# EAGLE design airball_sensor_board_v8_main (EAGLE 9.6.0)

## Sheet 1 of 3
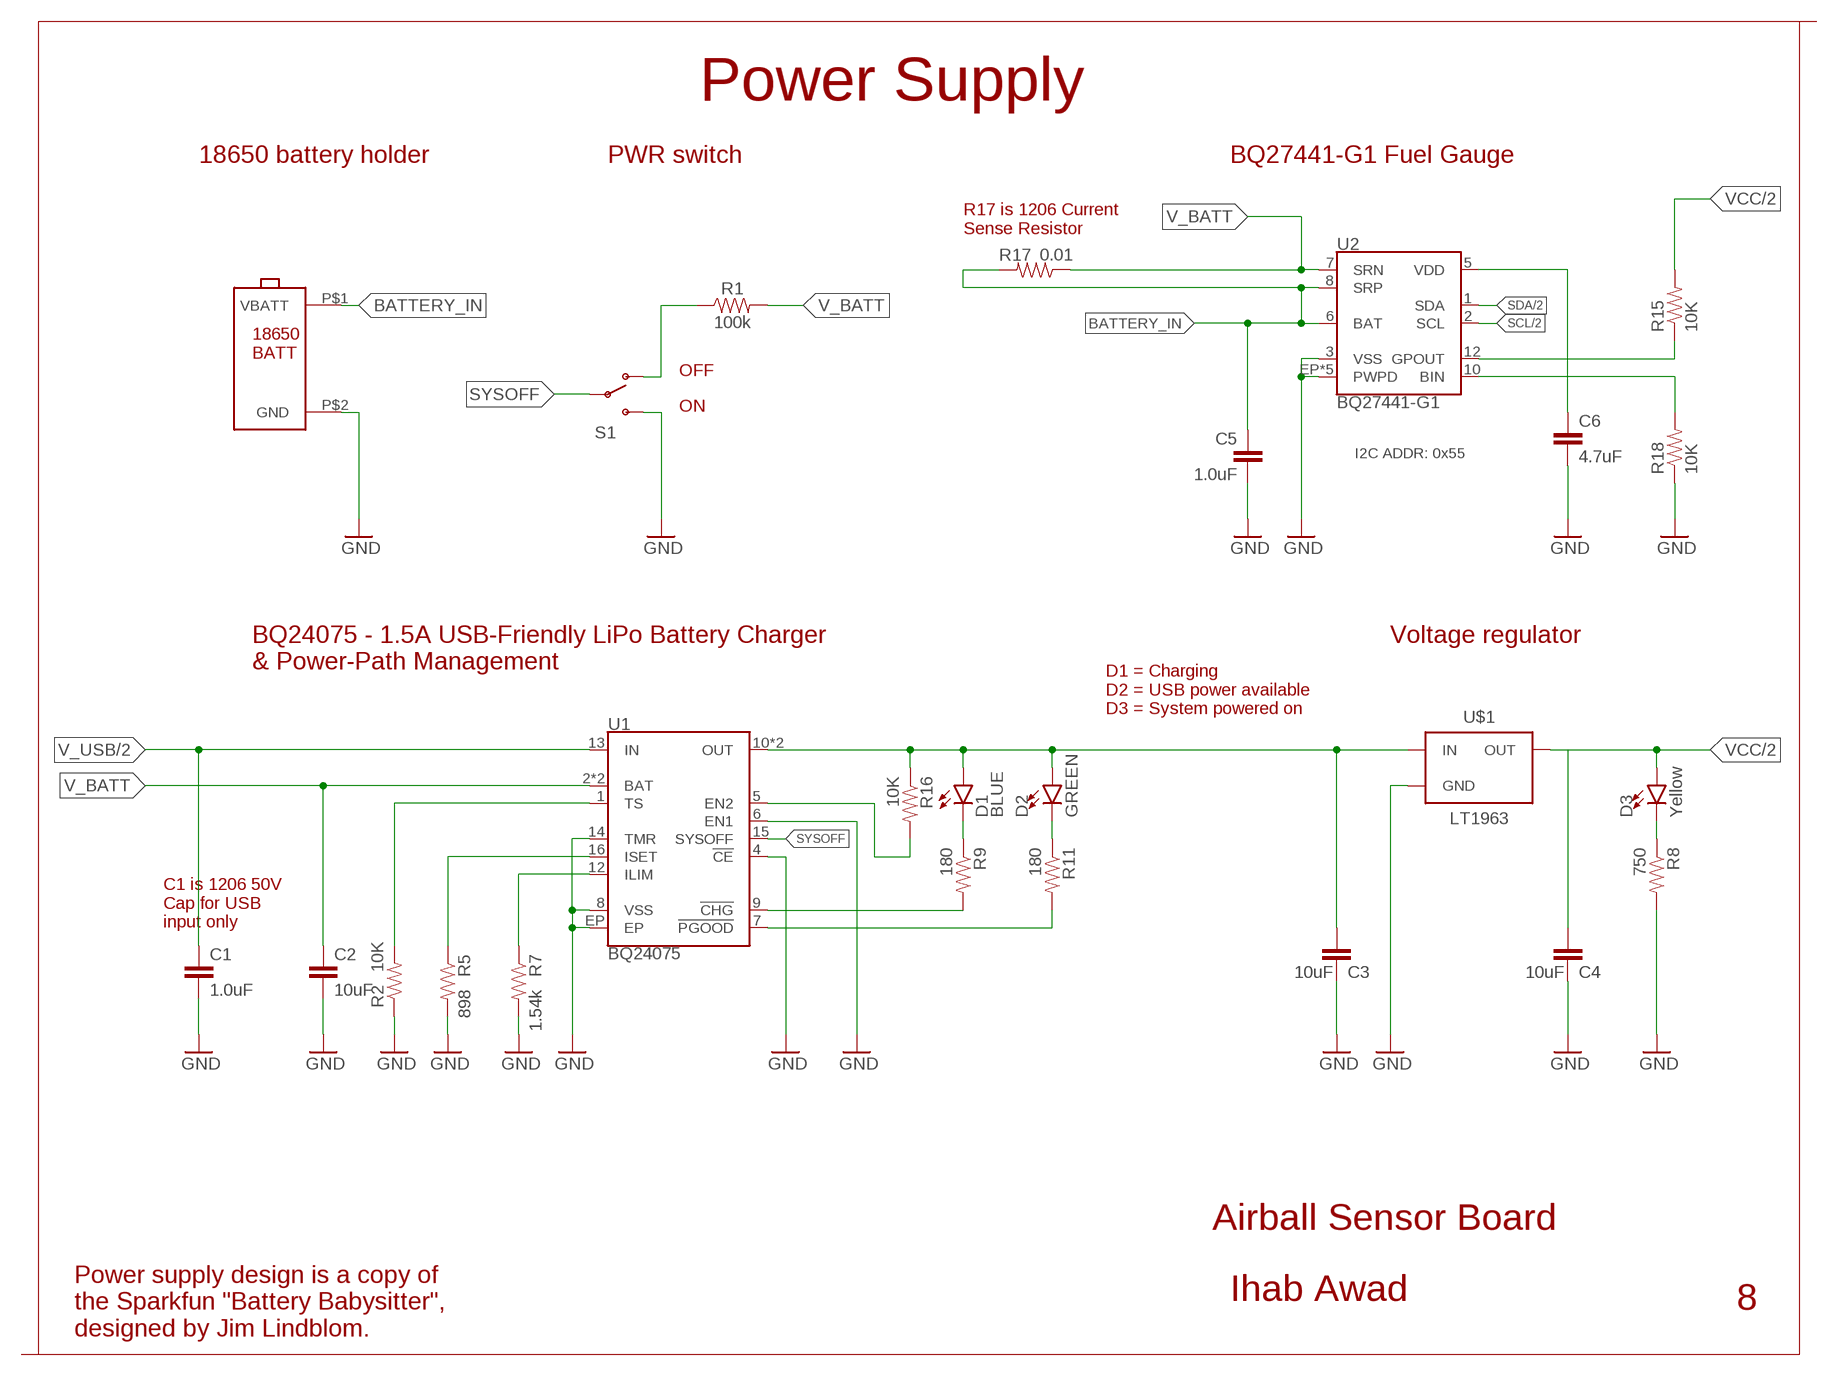
[diagram p0: schematic, sheet 1]

### Parts
C1  1.0uF  1.0UF50V10%(1206)  [1206-CAP]
C2  10uF  10UF10V10%(0805)  [0805-CAP]
C3  10uF  10UF10V10%(0805)  [0805-CAP]
C4  10uF  10UF10V10%(0805)  [0805-CAP]
C5  1.0uF  1.0UF-16V-10%(0603)  [0603-CAP]
C6  4.7uF  4.7UF-0603-35V-(20%)  [0603]
D1  BLUE  LED-BLUE0603  [LED-0603]
D2  GREEN  LED-GREEN0603  [LED-0603]
D3  Yellow  LED-YELLOW0603  [LED-0603]
R1  100k  100KOHM-0603-1/10W-1%  [0603]
R2  10K  10KOHM-1/10W-1%(0603)0603  [0603-RES]
R5  898  RESISTOR0603-RES  [0603-RES]
R7  1.54k  RESISTOR0603-RES  [0603-RES]
R8  750  10KOHM-1/10W-1%(0603)0603  [0603-RES]
R9  180  180OHM1/10W1%(0603)  [0603-RES]
R11  180  180OHM1/10W1%(0603)  [0603-RES]
R15  10K  10KOHM-1/10W-1%(0603)0603  [0603-RES]
R16  10K  10KOHM-1/10W-1%(0603)0603  [0603-RES]
R17  0.01  RESISTOR1206  [1206]
R18  10K  10KOHM-1/10W-1%(0603)0603  [0603-RES]
S1  SWITCH-SPDTSMD  [SWITCH_SPDT_SMD]
U1  BQ24075  [PVQFN-N16]
U2  BQ27441-G1  [PDSO-N12]
U$1  LT1963  [SOT223-3]
U$2  KEYSTONE_1042P_18650_BATT_HOLDER  [KEYSTONE_1042P_18650_BATT_HOLDER]

### Nets
!CHG!: R9.2 U1.9(!CHG!)
BATTERY_IN: C5.1 R17.2 U2.6(BAT) U2.8(SRP) U$2.P$1(VBATT)
GND: C1.2 C2.2 C3.2 C4.2 C5.2 C6.2 R2.1 R5.2 R7.2 R8.2 R18.1 S1.3(S) U1.4(!CE!) U1.6(EN1) U1.8(VSS) U1.14(TMR) U1.EP U2.3(VSS) U2.EP1(PWPD) U2.EP2(PWPD) U2.EP3(PWPD) U2.EP4(PWPD) U2.EP(PWPD) U$1.2(GND) U$1.TAB(GND) U$2.P$2(GND) ; also sheet 2,3
GPOUT: R15.1 U2.12(GPOUT)
ILIM: R7.1 U1.12(ILIM)
ISET: R5.1 U1.16(ISET)
N$11: D1.C R9.1
N$14: C6.1 U2.5(VDD)
N$19: R11.2 U1.7(!PGOOD!)
N$20: D2.C R11.1
N$21: R16.2 U1.5(EN2)
N$22: D3.C R8.1
N$23: R18.2 U2.10(BIN)
SCL: U2.2(SCL) ; also sheet 2,3
SDA: U2.1(SDA) ; also sheet 2,3
SYSOFF: S1.2(P) U1.15(SYSOFF)
SYSOFF_PULLUP: R1.1 S1.1(O)
TS: R2.2 U1.1(TS)
V_BATT: C2.1 R1.2 R17.1 U1.2(BAT) U1.3(BAT) U2.7(SRN)
V_SUPPLY_UNREG: C3.1 D1.A D2.A R16.1 U1.10(OUT) U1.11(OUT) U$1.1(IN)
V_USB: C1.1 U1.13(IN) ; also sheet 2
VCC: C4.1 D3.A R15.2 U$1.3(OUT) ; also sheet 2,3

### Notes on the sheet
- Power Supply
- 18650 battery holder | PWR switch | BQ27441-G1 Fuel Gauge
- R17 is 1206 Current
  Sense Resistor
- OFF
- ON
- I2C ADDR: 0x55
- BQ24075 - 1.5A USB-Friendly LiPo Battery Charger 
  & Power-Path Management
- Voltage regulator
- D1 = Charging
  D2 = USB power available
  D3 = System powered on
- C1 is 1206 50V
  Cap for USB
  input only
- Airball Sensor Board
- Ihab Awad | 8
- Power supply design is a copy of
  the Sparkfun "Battery Babysitter",
  designed by Jim Lindblom.

## Sheet 2 of 3
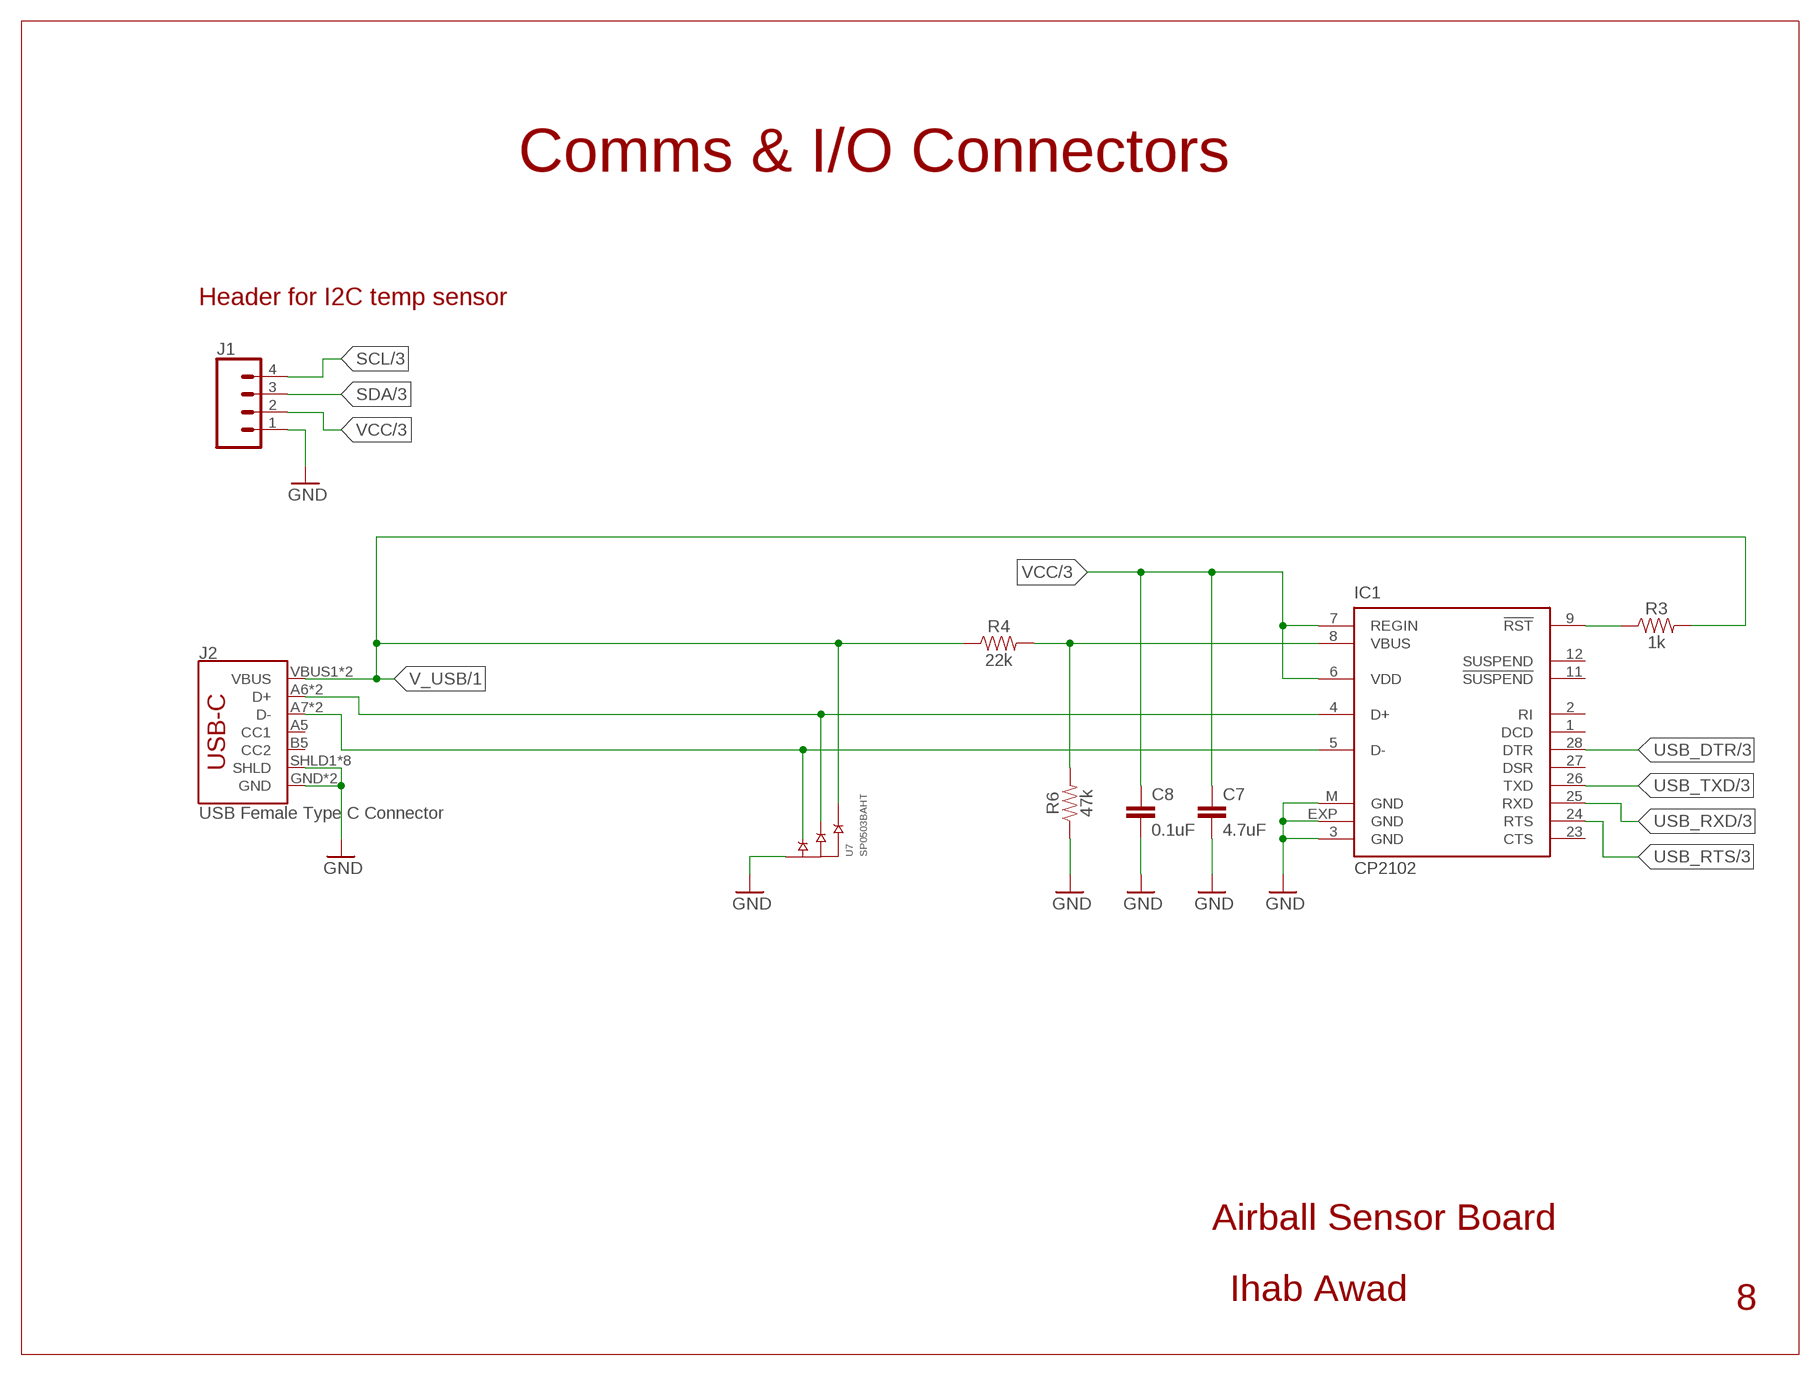
[diagram p1: schematic, sheet 2]

### Parts
C7  4.7uF  4.7UF-0603-35V-(20%)  [0603]
C8  0.1uF  0.1UF-0603-25V-(+80/-20%)  [0603]
IC1  CP2102  [MLP28]
J1  CONN_04JST-PTH  [JST-4-PTH]
J2  USB Female Type C Connector  USB_C  [USB-C-16P]
R3  1k  1KOHM-0603-1/10W-1%  [0603]
R4  22k  22KOHM-0603-1/10W-1%  [0603]
R6  47k  47KOHM-0603-1/10W-1%  [0603]
U7  SP0503BAHT  [SOT143]

### Nets
GND: C7.2 C8.2 IC1.3(GND) IC1.EXP(GND) IC1.M(GND) J1.1 J2.GND J2.GND2(GND) J2.SHLD1(SHLD) J2.SHLD2(SHLD) J2.SHLD3(SHLD) J2.SHLD4(SHLD) J2.SHLD5(SHLD) J2.SHLD6(SHLD) J2.SHLD7(SHLD) J2.SHLD8(SHLD) R6.1 U7.1(GND) ; also sheet 1,3
N$4: IC1.9(!RST) R3.1
N$5: IC1.8(VBUS) R4.2 R6.2
SCL: J1.4 ; also sheet 1,3
SDA: J1.3 ; also sheet 1,3
USB_D+: IC1.4(D+) J2.A6(D+) J2.B6(D+) U7.3(B)
USB_D-: IC1.5(D-) J2.A7(D-) J2.B7(D-) U7.2(A)
USB_DTR: IC1.28(DTR) ; also sheet 3
USB_RTS: IC1.24(RTS) ; also sheet 3
USB_RXD: IC1.25(RXD) ; also sheet 3
USB_TXD: IC1.26(TXD) ; also sheet 3
V_USB: J2.VBUS1(VBUS) J2.VBUS2(VBUS) R3.2 R4.1 U7.4(C) ; also sheet 1
VCC: C7.1 C8.1 IC1.6(VDD) IC1.7(REGIN) J1.2 ; also sheet 1,3
Unconnected: IC1.1(DCD) IC1.2(RI) IC1.11(!SUSPEND) IC1.12(SUSPEND) IC1.23(CTS) IC1.27(DSR) J2.A5(CC1) J2.B5(CC2)

### Notes on the sheet
- Comms & I/O Connectors
- Header for I2C temp sensor
- Airball Sensor Board
- Ihab Awad | 8

## Sheet 3 of 3
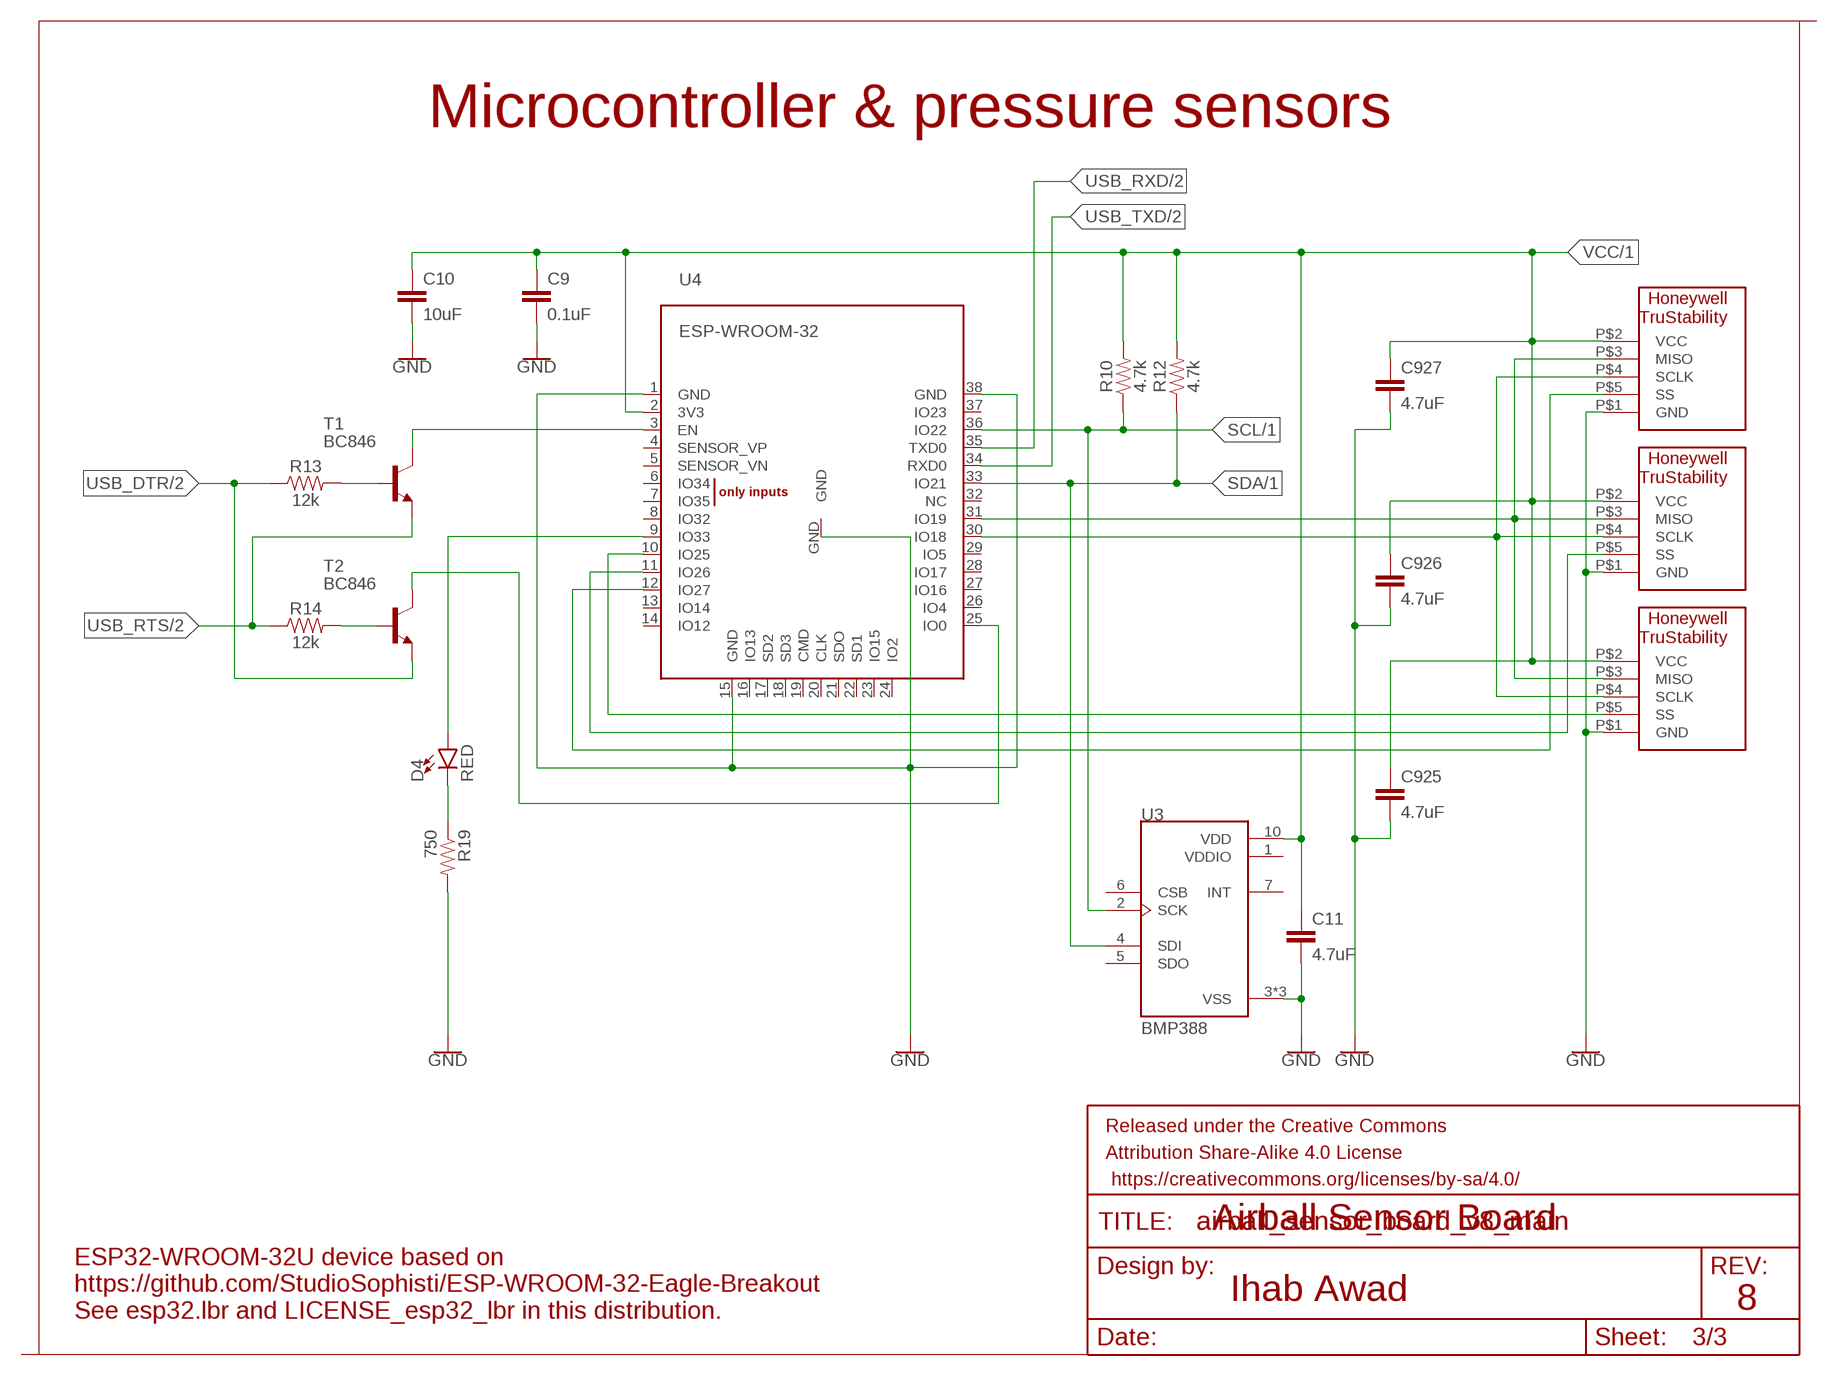
[diagram p2: schematic, sheet 3]

### Parts
C9  0.1uF  0.1UF-0603-25V-(+80/-20%)  [0603]
C10  10uF  10UF-0603-6.3V-20%  [0603]
C11  4.7uF  4.7UF-0603-6.3V-(10%)  [0603]
C925  4.7uF  4.7UF-0603-6.3V-(10%)  [0603]
C926  4.7uF  4.7UF-0603-6.3V-(10%)  [0603]
C927  4.7uF  4.7UF-0603-6.3V-(10%)  [0603]
D4  RED  LED-RED0603  [LED-0603]
FRAME3  FRAME-LETTER  [CREATIVE_COMMONS]
R10  4.7k  4.7KOHM-0603-1/10W-1%  [0603]
R12  4.7k  4.7KOHM-0603-1/10W-1%  [0603]
R13  12k  12KOHM-0603-1/10W-1%  [0603]
R14  12k  12KOHM-0603-1/10W-1%  [0603]
R19  750  10KOHM-1/10W-1%(0603)0603  [0603-RES]
T1  BC846  [SOT23]
T2  BC846  [SOT23]
U3  BMP388  [PQFN50P200X200X80-10N]
U4  ESP-WROOM-32  [ESP-WROOM-32]
U$925  HONEYWELL_HSC_SMT  [HONEYWELL_HSC_SMT]
U$926  HONEYWELL_HSC_SMT  [HONEYWELL_HSC_SMT]
U$927  HONEYWELL_HSC_SMT  [HONEYWELL_HSC_SMT]

### Nets
GND: C9.2 C10.2 C11.2 C925.2 C926.2 C927.2 R19.2 U3.3(VSS) U3.8(VSS) U3.9(VSS) U4.1(GND) U4.15(GND) U4.38(GND) U4.GND U$925.P$1(GND) U$926.P$1(GND) U$927.P$1(GND) ; also sheet 1,2
MISO: U4.31(IO19) U$925.P$3(MISO) U$926.P$3(MISO) U$927.P$3(MISO)
N$1: D4.A U4.9(IO33)
N$2: D4.C R19.1
N$7: R13.2 T1.1(B)
N$8: R14.2 T2.1(B)
N$12: T1.3(C) U4.3(EN)
N$13: T2.3(C) U4.25(IO0)
SCL: R10.1 U3.2(SCK) U4.36(IO22) ; also sheet 1,2
SCLK: U4.30(IO18) U$925.P$4(SCLK) U$926.P$4(SCLK) U$927.P$4(SCLK)
SDA: R12.1 U3.4(SDI) U4.33(IO21) ; also sheet 1,2
SS_25: U4.10(IO25) U$925.P$5(SS)
SS_26: U4.11(IO26) U$926.P$5(SS)
SS_27: U4.12(IO27) U$927.P$5(SS)
USB_DTR: R13.1 T2.2(E) ; also sheet 2
USB_RTS: R14.1 T1.2(E) ; also sheet 2
USB_RXD: U4.35(TXD0) ; also sheet 2
USB_TXD: U4.34(RXD0) ; also sheet 2
VCC: C9.1 C10.1 C11.1 C925.1 C926.1 C927.1 R10.2 R12.2 U3.10(VDD) U4.2(3V3) U$925.P$2(VCC) U$926.P$2(VCC) U$927.P$2(VCC) ; also sheet 1,2
Unconnected: U3.5(SDO) U3.6(CSB) U3.7(INT) U4.4(SENSOR_VP) U4.5(SENSOR_VN) U4.6(IO34) U4.7(IO35) U4.8(IO32) U4.13(IO14) U4.14(IO12) U4.16(IO13) U4.17(SD2) U4.18(SD3) U4.19(CMD) U4.20(CLK) U4.21(SDO) U4.22(SD1) U4.23(IO15) U4.24(IO2) U4.26(IO4) U4.27(IO16) U4.28(IO17) U4.29(IO5) U4.32(NC) U4.37(IO23)

### Notes on the sheet
- Microcontroller & pressure sensors
- Airball Sensor Board
- Ihab Awad | 8
- ESP32-WROOM-32U device based on
  https://github.com/StudioSophisti/ESP-WROOM-32-Eagle-Breakout
  See esp32.lbr and LICENSE_esp32_lbr in this distribution.

## Power pins joined to a net without a drawn wire
VDDIO: U3.1(VDDIO)

## Library data of the parts
C1 = SparkFun-Capacitors:1.0UF50V10%(1206): CAP-09822; PROD_ID: CAP-09822
C2-C4 = SparkFun-Capacitors:10UF10V10%(0805): CAP-11330; PROD_ID: CAP-11330
C5 = SparkFun-Capacitors:1.0UF-16V-10%(0603): CAP-00868; PROD_ID: CAP-00868
C6 C7 = SparkFun-Capacitors:4.7UF: 4.7µF ceramic capacitors A capacitor is a passive two-terminal electrical component used to store electrical energy temporarily in an electric field.; PROD_ID: CAP-14106
C8 C9 = SparkFun-Capacitors:0.1UF: 0.1µF ceramic capacitors A capacitor is a passive two-terminal electrical component used to store electrical energy temporarily in an electric field.; PROD_ID: CAP-00810
C10 = SparkFun-Capacitors:10UF: 10.0µF ceramic capacitors A capacitor is a passive two-terminal electrical component used to store electrical energy temporarily in an electric field.; PROD_ID: CAP-11015
C11 C925-C927 = SparkFun-Capacitors:4.7UF: 4.7µF ceramic capacitors A capacitor is a passive two-terminal electrical component used to store electrical energy temporarily in an electric field.; PROD_ID: CAP-08280
D1 = SparkFun-LED:LED-BLUE: Blue SMD LED Used in manufacturing of various products at SparkFun Packages: 0603 - SMD 0603 package [Product Link] <http://www.digikey.com/product-detail/en/SMLE12BC7TT86/511-1589-2-ND/1641808> 1206 - SMD1206 package [Product Link] <http://www.digikey.com/product-detail/en/lite-on-inc/LTST-C150TBKT/160-1643-1-ND/573584> SparkFun Products: ESP8266 Thing-Dev Board <https://www.sparkfun.com/products/13711> RedBoard <https://www.sparkfun.com/products/12757>; PROD_ID: DIO-08575
D2 = SparkFun-LED:LED-GREEN: Green SMD LED Used in manufacturing of various products at SparkFun Packages: 0603 - SMD 0603 package [Product Link] <http://www.futureelectronics.com/en/technologies/semiconductors/optoelectronics/leds/Pages/9894312-LTST-C190GKT.aspx?CrossPart=HSMG-C190&IM=0> LilyPad 1206 - SMD1206 LilyPad package [Product Link] <http://www.futureelectronics.com/en/Technologies/Product.aspx?ProductID=IN150NGHARVATEKCORPORATION2049943&IM=0> 1206 - SMD1206 package [Product Link] <http://www.futureelectronics.com/en/technologies/semiconductors/optoelectronics/leds/Pages/8315665-LTST-C150KGKT.aspx?IM=0> 1206 Bottom Mount -SMD 1206 Bottom Mount [Product Link] <http://www.digikey.com/product-detail/en/lite-on-inc/LTST-C230KGKT/160-1456-1-ND/386854> SparkFun Products: Pro Mini 328 -5V <https://www.sparkfun.com/products/821> RedBoard <https://www.sparkfun.com/products/12757> MP3 Trigger <https://www.sparkfun.com/products/13720> Makey Makey <https://www.sparkfun.com/products/11076>; PROD_ID: DIO-00821
D3 = SparkFun-LED:LED-YELLOW: Yellow SMD LED Used in manufacturing several products at SparkFun. Packages: 0603 - SMD 0603 package[Product Link] <http://www.kingbrightusa.com/product.asp?catalog_name=LED&product_id=APT1608SYCK> 0603 -SMART - SMART SMD 0603 package (more efficient/more expensive) [Product Link] <http://www.osram-os.com/osram_os/en/products/product-catalog/led-light-emitting-diodes/smartled-0603/ly-l29k/index.jsp> LilyPad - SMD1206 package[Product Datasheet] <https://www.sparkfun.com/datasheets/DevTools/LilyPad/Q150YUS4.pdf> SparkFun Products: Blynk Board <https://www.sparkfun.com/products/13794> IOIO-OTG <https://www.sparkfun.com/products/13613> XBee Explorer Serial <https://www.sparkfun.com/products/13225>; PROD_ID: DIO-09003
D4 = SparkFun-LED:LED-RED: Red SMD LED Used in manufacturing of most products at SparkFun Packages: 0603 - SMD 0603 package [Product Link] <http://docs.avagotech.com/docs/AV02-0551EN> 0603 SMART - SMD 0603 SMART package ( more efficient and expensive)[Product Link] <http://www.osram-os.com/Graphics/XPic2/00077099_0.pdf> 1206 - SMD1206 package [Product Link] <https://www.sparkfun.com/datasheets/DevTools/LilyPad/Q150OVS4.pdff> SparkFun Products: Pro Mini 328 -5V <https://www.sparkfun.com/products/821> RedBoard <https://www.sparkfun.com/products/12757> IOIO-OTG <https://www.sparkfun.com/products/13613>; PROD_ID: DIO-00819
FRAME3 = SparkFun-Aesthetics:FRAME-LETTER: Schematic Frame Standard 8.5x11 US Letter frame
IC1 = silabs:CP210*: Single-Chip USB to UART Bridge Source: www.silabs.com .. CP2101.pdf / cp2102.pdf; MF: FARNELL; MPN: CP2102-GM; OC_FARNELL: 9282130; OC_NEWARK: 30K5635
J1 = SparkFun-Connectors:CONN_04: Multi connection point. Often used as Generic Header-pin footprint for 0.1 inch spaced/style header connections On any of the 0.1 inch spaced packages, you can populate with these: Break Away Headers - Straight <https://www.sparkfun.com/products/116> (PRT-00116) Break Away Male Headers - Right Angle <https://www.sparkfun.com/products/553> (PRT-00553) Female Headers <https://www.sparkfun.com/products/115> (PRT-00115) Break Away Headers - Machine Pin <https://www.sparkfun.com/products/117> (PRT-00117) Break Away Female Headers - Swiss Machine Pin <https://www.sparkfun.com/products/743> (PRT-00743) For SCREWTERMINALS and SPRING TERMINALS visit here: Screw Terimnals on SparkFun.com <https://www.sparkfun.com/search/results?term=Screw+Terminals> (5mm/3.5mm/2.54mm spacing) This device is also useful as a general connection point to wire up your design to another part of your project. Our various solder wires solder well into these plated through hole pads. Hook-Up Wire - Assortment (Stranded, 22 AWG) <https://www.sparkfun.com/products/11375> (PRT-11375) Hook-Up Wire - Assortment (Solid Core, 22 AWG) <https://www.sparkfun.com/products/11367> (PRT-11367) View the entire wire category on our website here <https://www.sparkfun.com/categories/141> Special notes: Molex polarized connector foot print use with SKU : PRT-08231 with associated crimp pins and housings. 1MM SMD Version SKU: PRT-10208; PROD_ID: WIRE-13531; SF_ID: PRT-09916
J2 = SparkFun-Connectors:USB_C: USB Type C 16Pin Connector Super Speed pins not available on the 16-pin purely SMD connector so this part is best for USB 2.0 implementations. D1 and D2 are tied together enabling D+/- no matter which way the cable is plugged into the connector. The two channel configuration pins (CC1/2) are exposed. These are normally connected to ground via 5.1k resistors but can be reconfigured for high current/high power applications.; PROD_ID: CONN-14122
R1 = SparkFun-Resistors:100KOHM: 100kΩ resistor A resistor is a passive two-terminal electrical component that implements electrical resistance as a circuit element. Resistors act to reduce current flow, and, at the same time, act to lower voltage levels within circuits. - Wikipedia; PROD_ID: RES-07828
R2 R15 R16 R18 = SparkFun-Resistors:10KOHM-1/10W-1%(0603): RES-00824; PROD_ID: RES-00824
R3 = SparkFun-Resistors:1KOHM: 1kΩ resistor A resistor is a passive two-terminal electrical component that implements electrical resistance as a circuit element. Resistors act to reduce current flow, and, at the same time, act to lower voltage levels within circuits. - Wikipedia; PROD_ID: RES-07856
R4 = SparkFun-Resistors:22KOHM: 22kΩ resistor A resistor is a passive two-terminal electrical component that implements electrical resistance as a circuit element. Resistors act to reduce current flow, and, at the same time, act to lower voltage levels within circuits. - Wikipedia; PROD_ID: RES-07853
R5 = SparkFun-Passives:RESISTOR: Resistor Basic schematic elements and footprints for 0603, 1206, and PTH resistors.; PROD_ID: RES-13217
R6 = SparkFun-Resistors:47KOHM: 47kΩ resistor A resistor is a passive two-terminal electrical component that implements electrical resistance as a circuit element. Resistors act to reduce current flow, and, at the same time, act to lower voltage levels within circuits. - Wikipedia; PROD_ID: RES-07871
R7 = SparkFun-Passives:RESISTOR: Resistor Basic schematic elements and footprints for 0603, 1206, and PTH resistors.; PROD_ID: RES-10447
R8 R19 = SparkFun-Resistors:10KOHM-1/10W-1%(0603): RES-00824; PROD_ID: RES-00824; VALUE: 10K
R9 R11 = SparkFun-Resistors:180OHM1/10W1%(0603): RES-08788; PROD_ID: RES-08788
R10 R12 = SparkFun-Resistors:4.7KOHM: 4.7kΩ resistor A resistor is a passive two-terminal electrical component that implements electrical resistance as a circuit element. Resistors act to reduce current flow, and, at the same time, act to lower voltage levels within circuits. - Wikipedia; PROD_ID: RES-07857
R13 R14 = SparkFun-Resistors:12KOHM: 12kΩ resistor A resistor is a passive two-terminal electrical component that implements electrical resistance as a circuit element. Resistors act to reduce current flow, and, at the same time, act to lower voltage levels within circuits. - Wikipedia; PROD_ID: RES-10327
R17 = SparkFun-Resistors:RESISTOR: Resistor Basic schematic elements and footprints for 0603, 1206, and PTH resistors.; PROD_ID: RES-13218
S1 = SparkFun-Retired:SWITCH-SPDT: SPDT Switch Simple slide switch, Spark Fun Electronics SKU : COM-00102 DPDT SMT slide switch, AYZ0202, SWCH-08179
T1 T2 = transistor:BC846: NPN TRANSISTOR
U1 = battery-management-temp:BQ24075; PROD_ID: IC-13219
U2 = battery-management-temp:BQ27441-G1; PROD_ID: IC-13220
U3 = BMP388:BMP388: P-Sensor SPI I2C 1, 25 Bar SMD; AVAILABILITY: Unavailable; DESCRIPTION: Pressure Sensor 4.35PSI ~ 18.13PSI _30kPa ~ 125kPa_ Absolute 10-WFLGA; MF: Bosch Sensortec; MP: BMP388; PACKAGE: WFLGA-10 Bosch Tools; PRICE: None
U4 = esp32:ESP-WROOM-32
U7 = SP0503BAHT:SP0503BAHT; DESCRIPTION: 8.5V Clamp Ipp Tvs Diode Surface Mount SOT-143-4; DIGI-KEY_PART_NUMBER: F2715TR-ND; DIGI-KEY_PURCHASE_URL: https://www.digikey.com/product-detail/en/littelfuse-inc/SP0503BAHTG/F2715TR-ND/1154308?utm_source=snapeda&utm_medium=aggregator&utm_campaign=symbol; MF: Littelfuse Inc.; MP: SP0503BAHT; PACKAGE: SOT-143 Littelfuse
U$1 = airball:LT1963
U$2 = airball:KEYSTONE_1042P_18650_BATT_HOLDER
U$925-U$927 = airball:HONEYWELL_HSC_SMT

## Board
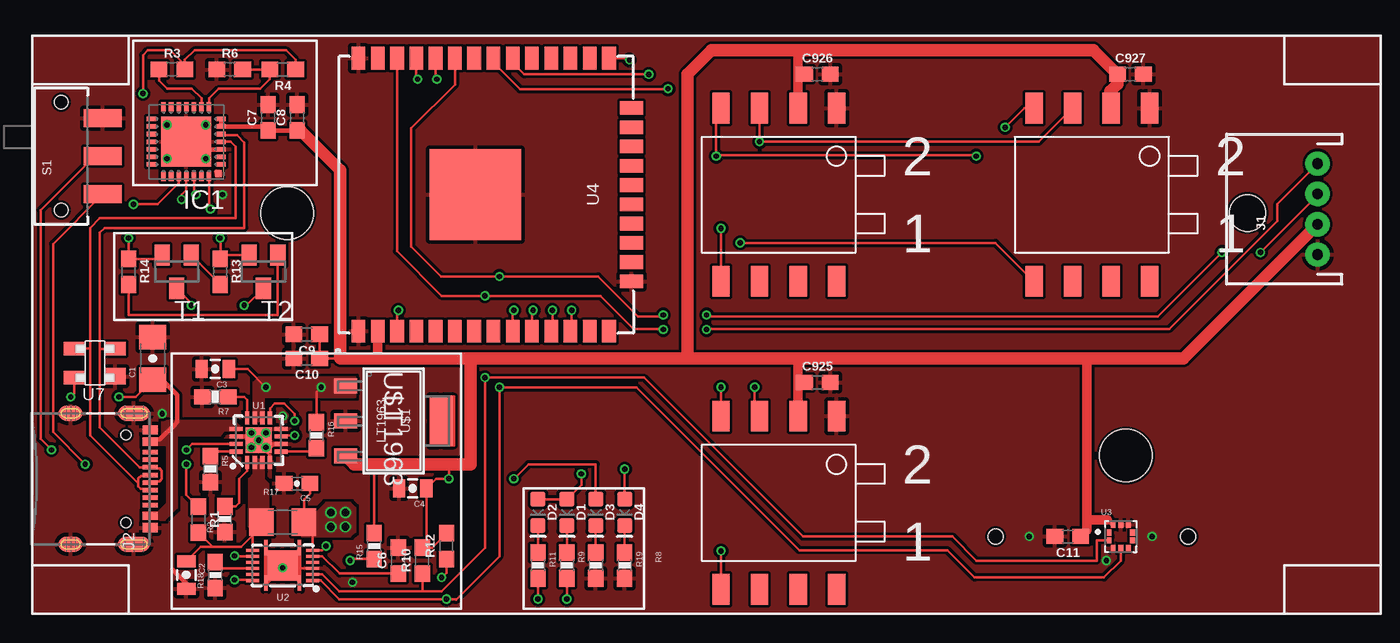
[diagram p3: board, top side]
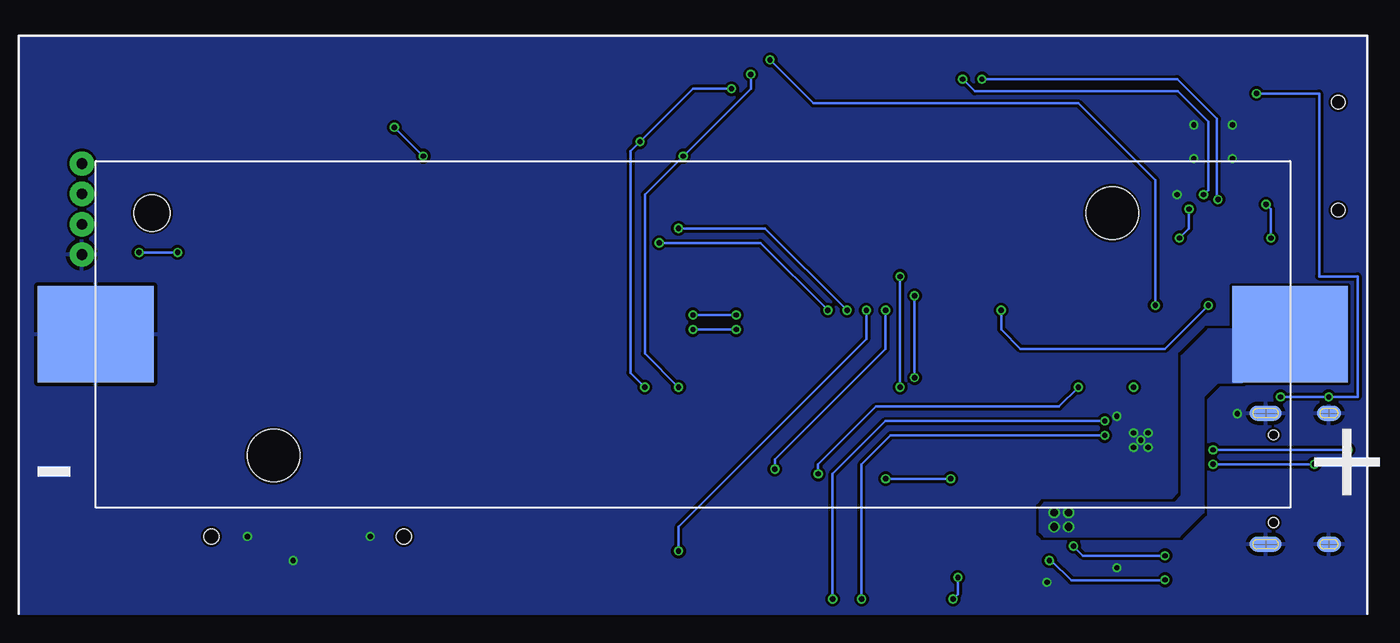
[diagram p4: board, bottom side, seen from below]

No outline drawn. Coordinates in mm, seen from the top.
Copper layers (1*16): Top 0.035mm / dielectric 1.5mm / Bottom 0.035mm
Design rules "SparkFun-2-layer-FAB-LIMIT *": minimum track width 7mil, minimum drill 6mil, track to track 7mil, track to pad 7mil, pad to pad 7mil, via to via 7mil, smd to smd 7mil, copper to edge 7mil, drill to drill 7mil, minimum pad ring 5mil, minimum via ring 5mil, stop-mask expansion 4mil, vias tented up to drill 20mil, thermal gap 10mil
Holes 1 mm at 63.5,5.08 76.2,5.08

### Footprints (pad centres in the part's own frame; a part is rotated, then mirrored left to right if it is on the bottom)
1206-CAP = smd 1.6 x 1.8: 1 -1.4,0; 2 1.4,0
0805-CAP = smd 0.8 x 1.2: 1 -0.9,0; 2 0.9,0
0603-CAP = smd 1.1 x 1: 1 -0.85,0; 2 0.85,0
0603 = smd 1.1 x 1: 1 -0.85,0; 2 0.85,0
LED-0603 = smd 1 x 1: A -0.877,0; C 0.877,0
MLP28 = smd 0.6 x 0.3: 1 -2.3,1.5; 2 -2.3,1; 3 -2.3,0.5; 4 -2.3,0; 5 -2.3,-0.5; 6 -2.3,-1; 7 -2.3,-1.5; 15 2.3,-1.5; 16 2.3,-1; 17 2.3,-0.5; 18 2.3,0; 19 2.3,0.5; 20 2.3,1; 21 2.3,1.5 | smd 0.3 x 0.6: 8 -1.5,-2.3; 9 -1,-2.3; 10 -0.5,-2.3; 11 0,-2.3; 12 0.5,-2.3; 13 1,-2.3; 14 1.5,-2.3; 22 1.5,2.3; 23 1,2.3; 24 0.5,2.3; 25 0,2.3; 26 -0.5,2.3; 27 -1,2.3; 28 -1.5,2.3 | smd 3.3 x 3.3: EXP 0,0 | smd 0.435 x 0.435: M -2.103,2.103
JST-4-PTH = drill 0.7 pad 1.6: 1 -3,0; 2 -1,0; 3 1,0; 4 3,0
USB-C-16P = smd 0.3 x 1.016: A5 -1.25,0.154; A6 -0.25,0.154; A7 0.25,0.154; A8 1.25,0.154; B5 1.75,0.154; B6 0.75,0.154; B7 -0.75,0.154; B8 -1.75,0.154 | smd 0.6 x 1.016: GND -3.225,0.154; GND2 3.225,0.154 | smd 1 x 2.1: SHLD1 -4.32,-0.915; SHLD2 4.32,-0.915 | smd 1 x 2.1 bottom: SHLD3 -4.32,-0.915; SHLD4 4.32,-0.915 | smd 1 x 1.6: SHLD5 -4.32,-5.095; SHLD8 4.32,-5.095 | smd 1 x 1.6 bottom: SHLD6 -4.32,-5.095; SHLD7 4.32,-5.095 | smd 0.55 x 1.016: VBUS1 -2.45,0.154; VBUS2 2.45,0.154 | hole 0.65: -2.89,-1.445; 2.89,-1.445
0603-RES = smd 1.1 x 1: 1 -0.85,0; 2 0.85,0
1206 = smd 1.6 x 1.8: 1 -1.4,0; 2 1.4,0
SWITCH_SPDT_SMD = smd 1.2 x 2.5: 1 -2.5,-2.75; 2 0,-2.75; 3 2.5,-2.75 | hole 0.9: -3.55,0; 3.55,0
SOT23 = smd 1 x 1.4: 1 -0.95,-1.1; 2 0.95,-1.1; 3 0,1.1
PVQFN-N16 = smd 0.28 x 0.85: 1 -0.75,-1.475; 2 -0.25,-1.475; 3 0.25,-1.475; 4 0.75,-1.475; 9 0.75,1.475; 10 0.25,1.475; 11 -0.25,1.475; 12 -0.75,1.475 | smd 0.85 x 0.28: 5 1.475,-0.75; 6 1.475,-0.25; 7 1.475,0.25; 8 1.475,0.75; 13 -1.475,0.75; 14 -1.475,0.25; 15 -1.475,-0.25; 16 -1.475,-0.75 | smd 1.7 x 1.7: EP 0,0
PDSO-N12 = smd 0.2 x 0.85: 1 -1,-1.975; 2 -0.6,-1.975; 3 -0.2,-1.975; 4 0.2,-1.975; 5 0.6,-1.975; 6 1,-1.975; 7 1,1.975; 8 0.6,1.975; 9 0.2,1.975; 10 -0.2,1.975; 11 -0.6,1.975; 12 -1,1.975 | smd 1.95 x 1.95: EP 0,0 | smd 1 x 0.25: EP1 -1.15,1.1; EP2 -1.15,-1.1; EP3 1.15,-1.1; EP4 1.15,1.1
PQFN50P200X200X80-10N = smd 0.35 x 0.38: 1 -0.765,0.25; 2 -0.765,-0.25; 3 -0.5,-0.765; 4 0,-0.765; 5 0.5,-0.765; 6 0.765,-0.25; 7 0.765,0.25; 8 0.5,0.765; 9 0,0.765; 10 -0.5,0.765
ESP-WROOM-32 = smd 0.9 x 1.5: 1 7.7,9; 2 6.43,9; 3 5.16,9; 4 3.89,9; 5 2.62,9; 6 1.35,9; 7 0.08,9; 8 -1.19,9; 9 -2.46,9; 10 -3.73,9; 11 -5,9; 12 -6.27,9; 13 -7.54,9; 14 -8.81,9; 25 -8.81,-9; 26 -7.54,-9; 27 -6.27,-9; 28 -5,-9; 29 -3.73,-9; 30 -2.46,-9; 31 -1.19,-9; 32 0.08,-9; 33 1.35,-9; 34 2.62,-9; 35 3.89,-9; 36 5.16,-9; 37 6.43,-9; 38 7.7,-9 | smd 1.5 x 0.9: 15 -10.3,5.715; 16 -10.3,4.445; 17 -10.3,3.175; 18 -10.3,1.905; 19 -10.3,0.635; 20 -10.3,-0.635; 21 -10.3,-1.905; 22 -10.3,-3.175; 23 -10.3,-4.445; 24 -10.3,-5.715 | smd 6 x 6: GND 0,0
SOT143 = smd 1.4 x 1.1: 1 -1.35,0.86 | smd 1.4 x 0.9: 2 -1.35,-0.96; 3 1.35,-0.96; 4 1.35,0.96
SOT223-3 = smd 1 x 1.5: 1 -2.3,-3.15; 2 0,-3.15; 3 2.3,-3.15 | smd 3.3 x 1.5: TAB 0,3.15
KEYSTONE_1042P_18650_BATT_HOLDER = smd 7.62 x 6.35: P$1 -39.37,0; P$2 39.37,0 | hole 3.454: -27.635,-8.001; 27.635,8.001 | hole 2.388: 35.662,-8.001
HONEYWELL_HSC_SMT = smd 1.143 x 2.032: P$1 -3.81,-5.715; P$2 -1.27,-5.715; P$3 1.27,-5.715; P$4 3.81,-5.715; P$5 3.81,5.715; P$6 1.27,5.715; P$7 -1.27,5.715; P$8 -3.81,5.715

### Placement (x,y rotation side)
C1  7.94,16.83 90 top
C2  10.16,2.54 270 top
C3  12.06,16.13 180 top
C4  25.08,8.26 180 top
C5  17.46,8.57 180 top
C6  24.13,3.49 90 top
C7  15.56,32.7 90 top
C8  17.46,32.7 90 top
C9  18.1,18.41 180 top
C10  18.1,16.83 180 top
C11  68.26,5.08 180 top
C925  51.75,15.24 0 top
C926  51.75,35.56 0 top
C927  72.39,35.56 0 top
D1  35.24,6.67 270 top
D2  33.34,6.67 270 top
D3  37.15,6.67 270 top
D4  39.05,6.67 270 top
FRAME3  15.24,-8.57 0 top
IC1  10.16,31.11 180 top
J1  84.73,26.67 90 top
J2  7.62,8.89 270 top
R1  10.95,6.19 270 top
R2  12.7,6.22 90 top
R3  9.21,35.88 0 top
R4  16.51,35.88 180 top
R5  11.75,9.53 270 top
R6  13.02,35.88 0 top
R7  12.06,14.29 180 top
R8  37.15,3.17 270 top
R9  35.24,3.17 270 top
R10  25.72,3.49 90 top
R11  33.34,3.17 270 top
R12  27.3,4.45 90 top
R13  12.38,22.54 270 top
R14  6.35,22.54 270 top
R15  22.54,4.45 90 top
R16  18.73,11.75 270 top
R17  16.51,6.03 0 top
R18  12.06,2.54 90 top
R19  39.05,3.17 270 top
S1  1.91,30.16 90 top
T1  9.53,22.54 180 top
T2  15.24,22.54 180 top
U1  14.92,11.43 0 top
U2  16.51,3.17 90 top
U3  71.75,5.08 0 top
U4  29.21,27.62 180 top
U7  4.13,16.51 180 top
U$1  23.81,12.7 270 top
U$2  44.45,18.41 180 bottom
U$925  49.21,7.3 180 top
U$926  49.21,27.62 180 top
U$927  69.85,27.62 180 top

### Tracks (layer width: path | path; a pad name or v marks a point on that pad's centre or on a via)
!CHG!  (via drill 0.35)
  Top 0.178: U1.9 15.67,13.54 15.99,13.86 16.62,13.86 17.3,13.18 v17.3,12.7 | R9.2 v35.24,0.95
  Bottom 0.178: v35.24,0.95 35.24,9.21 31.75,12.7 v17.3,12.7
BATTERY_IN  (via drill 0.35, 0.5)
  Top 0.178: R17.2 18.48,5.46 U2.6 19.1,4.17 v19.37,4.45 | R17.2 18.31,6.43 | v13.34,3.81 13.34,3.77 U2.8 | R17.2 17.91,7.54 18.31,7.94 C5.1
  Bottom 0.178: v13.34,3.81 18.73,3.81 v19.37,4.45
  other vias: 19.68,6.67 20.64,6.67 19.68,5.71 20.64,5.71
  pour Top (no thermals): 20.95,5.08 21.27,5.4 21.27,6.99 20.95,7.3 19.37,7.3 18.73,6.67 17.78,6.67 17.78,5.08
  pour Bottom (no thermals): 8.26,15.24 9.84,15.24 10.79,14.29 10.79,6.67 12.38,5.08 21.27,5.08 21.59,5.4 21.59,6.99 21.27,7.3 12.7,7.3 12.22,7.78 12.22,16.99 10.48,18.73 8.26,18.73
GND  (via drill 0.35)
  Top 0.178: IC1.3 10.82,30.61 | U2.3 16.55,2.98 v16.51,3.02 | U2.EP 17.61,4.28 U2.EP3 | U2.EP 16.43,3.25 15.41,4.28 U2.EP4 | U2.EP 16.51,3.16 | U2.EP 17.61,2.08 U2.EP2 | U1.4 15.67,10.43 15.65,10.41 14.92,11.15 U1.EP
  Top 0.305: U1.6 16.37,11.15 15.84,11.15 15.64,10.95 v15.4,10.95 | 14.71,10.95 v15.4,10.95 | 10.54,1.59 9.23,2.9 | IC1.3 12.44,30.59 11.71,30.59 11.43,30.32 v11.43,30 | IC1.M 12.14,29.14 | U1.14 14.22,11.68 v14.45,11.91 | U1.8 16.38,12.17 16.29,12.17 16.27,12.15 | U2.EP1 16.43,3.05 16.43,3.25 | 15.16,10.95 v15.4,10.95
  Top 0.406: 10.82,30.61 10.32,31.11 IC1.EXP
  other vias: 14.92,11.43 15.4,11.91 14.45,10.95 8.89,32.23 11.43,32.23 8.89,30 12.54,27.62 21.11,2.06 70.8,3.49 73.82,5.08 65.72,5.08 8.57,13.18 16.51,13.02
  pour Top (rank 6): 0,38.1 88.9,38.1 88.9,0 0,0
  pour Bottom (rank 6): 0,38.1 88.9,38.1 88.9,0 0,0
GPOUT  (via drill 0.35)
  Top 0.178: U2.12 14.5,2.21 14,2.21 13.98,2.22 v13.34,2.22 | R15.1 21.06,3.6 v20.95,3.49
  Bottom 0.178: v13.34,2.22 13.37,2.18 19.52,2.18 20.82,3.49 v20.95,3.49
ILIM
  Top 0.178: U1.12 14.17,14.09 13.97,14.29 R7.1
ISET
  Top 0.178: U1.16 12.05,10.68 R5.1
MISO  (via drill 0.35)
  Top 0.178: v47.62,14.92 47.62,13.34 U$925.P$3 | U$926.P$3 v47.94,31.11 66.36,31.11 U$927.P$3 | v41.91,34.61 41.87,34.57 32.15,34.57 30.4,36.31 U4.31
  Bottom 0.178: v47.62,14.92 48.58,15.88 48.58,30.48 v47.94,31.11 44.45,34.61 v41.91,34.61
N$1  (via drill 0.35)
  Top 0.178: U4.9 31.67,19.92 v31.75,20 | v39.05,9.53 D4.A
  Bottom 0.178: v31.75,20 31.75,17.46 39.05,10.16 v39.05,9.53
N$2
  Top 0.178: D4.C R19.1
N$4
  Top 0.178: IC1.9 11.16,33.97 10.53,34.61 8.89,34.61 8.36,35.14 R3.1
N$5
  Top 0.178: R6.2 R4.2 15.66,35.24 15.03,34.61 12.29,34.61 11.66,33.97 IC1.8
N$7
  Top 0.178: T1.1 12.38,21.73 R13.2
N$8
  Top 0.178: T2.1 16.19,19.68 6.35,19.68 R14.2
N$11
  Top 0.178: D1.C R9.1
N$12  (via drill 0.35)
  Top 0.178: T1.3 10.48,20.49 v10.48,20.32 | U4.3 24.05,19.92 v24.13,20
  Bottom 0.178: v10.48,20.32 13.34,17.46 22.86,17.46 24.13,18.73 v24.13,20
N$13  (via drill 0.35)
  Top 0.178: T2.3 14.12,20.32 v13.97,20.32 | U4.25 39.26,36.62 v39.37,36.51
  Bottom 0.178: v39.37,36.51 36.51,33.66 19.05,33.66 13.97,28.57 v13.97,20.32
N$14
  Top 0.178: C6.1 20.25,2.64 19.12,3.77 U2.5
N$19  (via drill 0.35)
  Top 0.178: U1.7 16.46,11.75 v17.3,11.75 | R11.2 v33.34,0.95
  Bottom 0.178: v33.34,0.95 33.34,9.84 31.43,11.75 v17.3,11.75
N$20
  Top 0.178: D2.C R11.1
N$21
  Top 0.178: U1.5 18.52,10.68 R16.2
N$22
  Top 0.178: D3.C R8.1
N$23
  Top 0.178: U2.10 12.48,2.98 R18.2
SCL  (via drill 0.35)
  Top 0.178: R10.1 25.72,1.46 | 25.72,1.46 20.23,1.46 19.12,2.58 U2.2 | U4.36 24.05,23.89 26.99,20.95 v29.84,20.95 37.47,20.95 39.65,18.77 41.59,18.77 v41.59,18.73 | 25.72,1.46 26.99,1.46 29.84,4.32 v29.84,15.56 40.32,15.56 50.8,5.08 60.64,5.08 62.23,3.49 70.17,3.49 70.17,4.83 U3.2 | J1.4 82.08,27.02 82.08,25.88 74.97,18.77 44.45,18.77 v44.45,18.73
  Bottom 0.178: v29.84,15.56 v29.84,20.95 | v44.45,18.73 v41.59,18.73
SCLK  (via drill 0.35)
  Top 0.178: U$925.P$4 v45.4,14.92 | U$926.P$4 45.09,33.02 v45.09,30.16 45.16,30.24 62.16,30.24 v62.23,30.16 | v40.64,35.56 32.42,35.56 31.67,36.31 U4.30 | v64.14,32.07 65.41,33.34 U$927.P$4
  Bottom 0.178: v45.4,14.92 47.62,17.14 47.62,27.62 v45.09,30.16 40.64,34.61 v40.64,35.56 | v64.14,32.07 v62.23,30.16
SDA  (via drill 0.35)
  Top 0.178: U4.33 27.86,34.87 24.99,32 24.99,24.2 26.96,22.23 v30.8,22.23 37.3,22.23 39.92,19.6 41.51,19.6 v41.59,19.68 | v78.42,23.81 74.21,19.6 44.53,19.6 v44.45,19.68 | v80.96,23.81 84.73,27.58 J1.3 | U3.4 71.75,3.49 70.64,2.38 62.12,2.38 60.33,4.18 50.57,4.18 39.82,14.92 v30.8,14.92 30.8,3.76 27.94,0.91 27.89,0.95 v27.3,0.95 20.24,0.95 19.02,2.17 U2.1 | R12.1 27.3,2.7 v26.99,2.38
  Bottom 0.178: v30.8,22.23 v30.8,14.92 | v78.42,23.81 v80.96,23.81 | v44.45,19.68 v41.59,19.68 | v26.99,2.38 26.99,1.27 v27.3,0.95
SS_25  (via drill 0.35)
  Top 0.178: U4.10 32.94,19.92 v33.02,20 | v45.4,4.13 U$925.P$5
  Bottom 0.178: v33.02,20 33.02,18.1 45.4,5.71 v45.4,4.13
SS_26  (via drill 0.35)
  Top 0.178: v34.29,20 34.29,18.7 U4.11 | v45.4,25.4 U$926.P$5
  Bottom 0.178: v34.29,20 39.69,25.4 v45.4,25.4
SS_27  (via drill 0.35)
  Top 0.178: v35.56,20 35.56,18.7 U4.12 | v46.67,24.45 63.5,24.45 U$927.P$5
  Bottom 0.178: v46.67,24.45 40.01,24.45 v35.56,20
SYSOFF  (via drill 0.35)
  Top 0.178: U1.15 12.37,11.18 12.36,11.19 10.56,11.19 v10.16,10.79 | v1.27,10.79 0.55,11.51 0.55,26.59 4.12,30.16 S1.2
  Bottom 0.178: v1.27,10.79 v10.16,10.79
SYSOFF_PULLUP  (via drill 0.35)
  Top 0.178: R1.1 10.16,7.83 v10.16,9.84 | v3.49,9.84 1.37,11.97 1.37,24.38 S1.1
  Bottom 0.178: v10.16,9.84 v3.49,9.84
TS
  Top 0.178: U1.1 14.17,9.41 13.65,8.89 13.65,7.3 13.42,7.07 R2.2
USB_D+
  Top 0.178: 7,8.57 7,8.9 7.18,9.08 7.71,9.08 J2.A6 | 7,8.57 7,8.38 7.16,8.22 7.69,8.22 J2.B6 | 7,8.57 3.81,11.76 3.81,17.46 | IC1.4 13.1,31.11 13.41,30.8 13.41,26.07 4.45,26.07 3.81,25.43 3.81,17.46 | U7.3 3.8,17.47 3.81,17.46
USB_D-
  Top 0.178: J2.A7 7.86,8.72 8.39,8.72 8.55,8.88 8.55,9.4 8.39,9.56 7.86,9.56 J2.B7 7.08,9.64 4.45,12.28 4.45,17.46 | IC1.5 12.54,31.53 13.51,31.53 13.98,31.06 13.98,25.43 4.76,25.43 4.45,25.11 4.45,17.46 | 4.45,17.46 U7.2
USB_DTR  (via drill 0.35)
  Top 0.178: 12.43,23.44 12.63,23.64 T2.2 | IC1.28 11.66,26.76 v11.75,26.67 | v12.38,24.77 12.43,24.71 12.43,23.44 | R13.1 12.43,23.44
  Bottom 0.178: v11.75,26.67 11.75,25.4 v12.38,24.77
USB_RTS  (via drill 0.35)
  Top 0.178: T1.2 8.32,23.39 R14.1 v6.35,24.77 | IC1.24 9.66,28.39 8.26,26.99 v6.67,26.99
  Bottom 0.178: v6.67,26.99 6.35,26.67 v6.35,24.77
USB_RXD  (via drill 0.35)
  Top 0.178: IC1.25 10.16,27.94 9.84,27.62 v9.84,27.3 | v25.4,35.24 25.32,35.32 U4.35
  Bottom 0.178: v9.84,27.3 9.91,27.37 9.91,32.62 12.53,35.24 v25.4,35.24
USB_TXD  (via drill 0.35)
  Top 0.178: IC1.26 10.66,27.76 v10.79,27.62 | v26.67,35.24 26.59,35.32 U4.34
  Bottom 0.178: v10.79,27.62 10.48,27.94 10.48,32.42 12.5,34.44 25.87,34.44 v26.67,35.24
V_BATT
  Top 0.178: U2.7 14.54,5.46 R17.1 15.11,5.71 13.79,4.39 11.9,4.39 | 11.9,4.39 11.11,4.39 C2.1 | 11.9,4.39 R1.2
  pour Top (no thermals): 14.61,10.16 15.24,10.16 15.24,8.89 15.56,8.57 15.56,5.71 14.29,5.71 14.29,8.89 14.61,9.21
V_SUPPLY_UNREG  (via drill 0.35)
  Top 0.178: D2.A D1.A 36.2,8.5 v36.2,9.21 | R16.1 18.73,14.61 v19.05,14.92 | C3.1 14.19,16.13 v15.4,14.92
  Bottom 0.178: v19.05,14.92 20.32,13.65 32.38,13.65 36.2,9.84 v36.2,9.21
  pour Top (no thermals): 14.61,12.7 15.24,12.7 15.24,14.29 21.27,14.29 21.27,15.56 14.92,15.56 14.61,15.24
V_USB  (via drill 0.35)
  Top 0.178: R4.1 17.36,36.51 16.73,37.15 10.69,37.15 10.06,36.51 R3.2 10.06,36.2 9.11,37.15 7.62,37.15 7.3,36.83 v7.3,34.29 | U7.4 2.78,14.53 v2.54,14.29 | v5.71,14.29 6.83,14.29 7.94,15.4 | 7.94,15.4 8.26,15.72 | C1.1 7.94,15.4
  Top 0.305: 8.26,15.72 9.56,14.41 9.56,12.63 9.42,12.49 8.42,11.48 7.92,11.48 J2.VBUS1
  Bottom 0.178: v7.3,34.29 3.17,34.29 3.17,22.23 0.64,22.23 0.64,14.29 v2.54,14.29 v5.71,14.29
  pour Top (no thermals): 7.3,11.59 9.53,11.59 9.53,6.99 8.73,6.19 7.3,6.19 7.3,6.67 8.26,6.67 8.89,7.3 8.89,11.11 7.3,11.11
  pour Top (no thermals): 13.65,12.06 12.7,12.06 12.38,11.75 8.57,11.75 8.57,12.7 13.34,12.7 13.65,12.38
  pour Top (no thermals): 8.57,12.7 9.53,12.7 9.53,11.43 8.57,11.43
VCC  (via drill 0.35)
  Top 0.178: R15.2 22.54,9.84 | R12.2 26.35,4.34 R10.2 25.98,4.61 C4.1 26.62,8.89 v27.46,8.89 27.46,9.84 | C9.1 C10.1 20.32,16.83 | D3.A 37.15,9.84 32.7,9.84 v31.75,8.89
  Top 0.254: U3.10 71.22,5.84 70.87,6.19
  Top 0.305: IC1.7 IC1.6 15.29,32.12 C7.1 C8.1
  Top 0.635: C8.1 17.7,31.85 | 20.31,16.84 20.32,16.83 | 50.48,37.15 50.48,35.56 | 50.48,35.56 U$926.P$2 | 50.48,16.83 50.48,15.24 | 50.48,15.24 U$925.P$2 | C11.1 69.53,5.5 69.53,6.19 | 69.53,16.83 69.53,6.19 | C926.1 50.48,35.56 | C925.1 50.48,15.24 | U4.2 22.78,16.91 22.86,16.83 | 69.53,6.19 70.87,6.19
  Top 0.813: U$1.3 21.22,9.84 22.54,9.84 27.46,9.84 28.89,9.84 28.89,16.83 | 20.32,16.83 22.86,16.83 28.89,16.83 | 17.7,31.85 20.31,29.24 20.31,16.84 | J1.2 75.89,16.83 69.53,16.83 50.48,16.83 43.18,16.83 | 28.89,16.83 43.18,16.83 | 43.18,16.83 43.18,35.56 44.77,37.15 50.48,37.15 69.95,37.15 C927.1 71.54,34.92 71.06,34.45 71.06,33.39 U$927.P$2
  Bottom 0.178: v31.75,8.89 v27.46,8.89

### Text on the board
tPlace: Ihab Awad
Measures: Units in inches